# EAGLE design tiny-dcdc-2.0 (EAGLE 6.5.0)
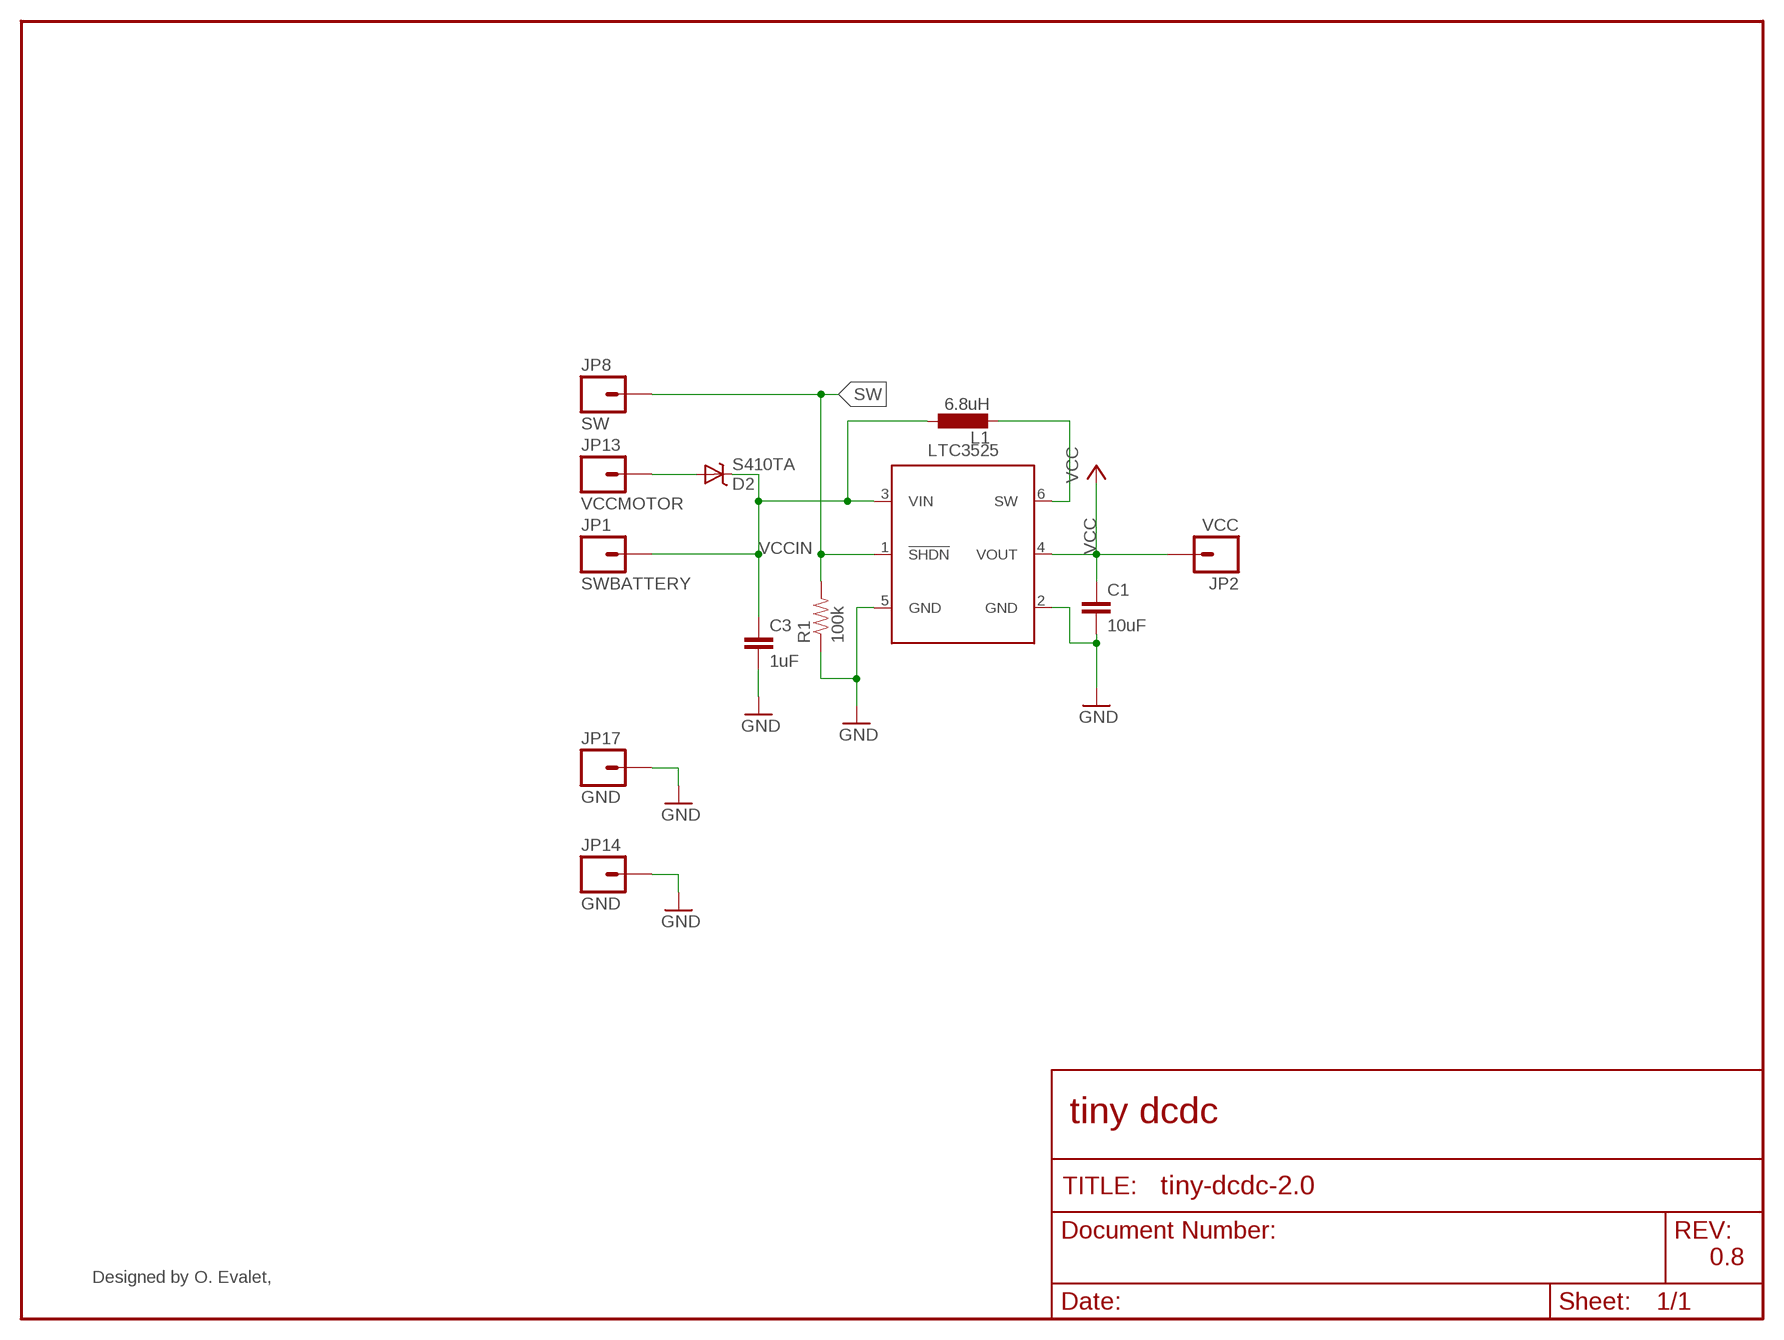
[diagram p0: schematic, sheet 1]

## Parts
C1  10uF  CAP0805  [0805]
C3  1uF  CAP0805  [0805]
D2  S410TA  DIODE-SCHOTTKYSOD323  [SOD-323]
JP1  SWBATTERY  M01URWERK-ROUND  [URWERK1X01]
JP2  VCC  M01URWERK-ROUND  [URWERK1X01]
JP8  SW  M01URWERK-ROUND  [URWERK1X01]
JP13  VCCMOTOR  M01URWERK-ROUND  [URWERK1X01]
JP14  GND  M01URWERK-ROUND  [URWERK1X01]
JP17  GND  M01URWERK-ROUND  [URWERK1X01]
L1  6.8uH  L-EUL2012C  [L2012C]
R1  100k  RESISTOR0805-RES  [0805]
U$3  LTC3525  [SC70-6L]

## Nets
GND: C1.2 C3.2 JP14.1 JP17.1 R1.1 U$3.2(GND) U$3.5(GND)
N$3: L1.2 U$3.6(SW)
SW: JP8.1 R1.2 U$3.1(!SHDN)
VCC: C1.1 JP2.1 U$3.4(VOUT)
VCCIN: C3.1 D2.1(C) JP1.1 L1.1 U$3.3(VIN)
VCCMOTOR: D2.2(A) JP13.1

## Notes on the sheet
- tiny dcdc
- 0.8
- Designed by O. Evalet,

## Library data of the parts
C1 C3 = 0-SparkFun:CAP: Capacitor Standard 0603 ceramic capacitor, and 0.1" leaded capacitor.
D2 = bicyclelab:DIODE-SCHOTTKY: ZLLS410 10V LOW LEAKAGE SCHOTTKY DIODE IN SOD323
JP1 JP2 JP8 JP13 JP14 JP17 = bicyclelab:M01: Header 1 Standard 1-pin 0.1" header. Use with straight break away headers (SKU : PRT-00116), right angle break away headers (PRT-00553), swiss pins (PRT-00743), machine pins (PRT-00117), and female headers (PRT-00115).
L1 = resistor:L-EU: INDUCTOR, European symbol
R1 = 0-SparkFun:RESISTOR: Resistor Basic schematic elements and footprints for 0603, 1206, and PTH resistors.
U$3 = bicyclelab:LTC3525

## Board
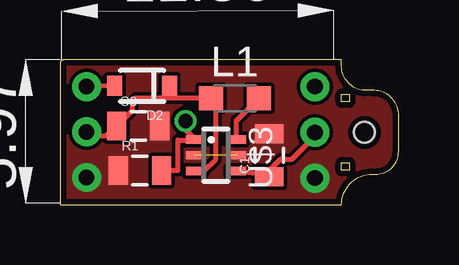
[diagram p1: board, top side]
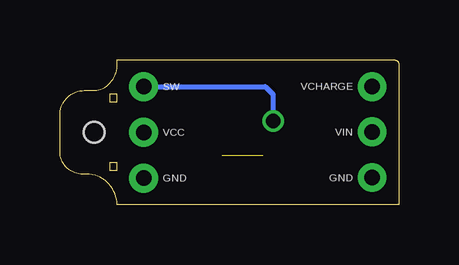
[diagram p2: board, bottom side, seen from below]

Size 14.13 x 6.03 mm. Coordinates in mm from the lower left corner, seen from the top.
Outline: 0,0 11.75,0 arc-90 13.02,1.27 13.18,1.27 arc90 14.13,2.22 14.13,3.81 arc90 13.02,4.76 12.7,4.76 arc-90 11.75,5.87 11.75,6.03 0.16,6.03 arc90 0,5.87 0,0
Outline: 11.75,4.6 12.06,4.6 12.06,4.29 11.75,4.29 11.75,4.6
Outline: 11.75,1.75 12.06,1.75 12.06,1.43 11.75,1.43 11.75,1.75
Copper layers (1*16): Top 0.035mm / dielectric 1.5mm / Bottom 0.035mm
Design rules "default": minimum track width 6mil, minimum drill 12mil, track to track 6mil, track to pad 6mil, pad to pad 6mil, via to via 6mil, smd to smd 0mil, copper to edge 10mil, drill to drill 10mil, minimum pad ring 10mil, minimum via ring 6mil, stop-mask expansion 2mil, vias tented up to drill 100mil, thermal gap 10mil
Holes 0.85 mm at 12.7,3.02

### Footprints (pad centres in the part's own frame; a part is rotated, then mirrored left to right if it is on the bottom)
0805 = smd 0.8 x 1.2: 1 -0.9,0; 2 0.9,0
SOD-323 = smd 0.63 x 0.83: 1 -1.15,0; 2 1.15,0
URWERK1X01 = drill 0.65 pad 1.2: 1 0,0
L2012C = smd 1 x 1: 1 -1,0; 2 1,0
SC70-6L = smd 0.35 x 0.8: 1 -0.65,-0.85; 2 0,-0.85; 3 0.65,-0.85; 4 0.65,0.85; 5 0,0.85; 6 -0.65,0.85

### Placement (x,y rotation side)
C1  8.73,2.06 90 top
C3  3.27,3.28 0 top
D2  3.43,4.95 180 top
JP1  1.11,3.04 90 top
JP2  10.64,3.02 0 top
JP8  10.64,4.92 90 top
JP13  1.11,4.92 90 top
JP14  10.64,1.11 270 top
JP17  1.11,1.14 0 top
L1  7.3,4.45 0 top
R1  3.33,1.43 0 top
U$3  6.51,2.06 270 top

### Tracks (layer width: path | path; a pad name or v marks a point on that pad's centre or on a via)
GND  (1 unrouted)
  pour Top (no thermals): 0,0 0,6.03 14.13,6.03 14.13,0
N$3
  Top 0.2: U$3.6 7.36,3.5 L1.2
SW  (via drill 0.6)
  Top 0.2: v5.24,3.49 5.24,3.13 U$3.1 5.66,2.7 4.92,2.7 4.92,1.43 R1.2
  Bottom 0.2: JP8.1 5.56,4.92 5.24,4.6 v5.24,3.49
VCC
  Top 0.2: U$3.4 8.66,1.25 C1.1 8.73,1.43 9.21,1.91 9.68,1.91 10.32,2.54 10.32,2.7 JP2.1
VCCIN
  Top 0.2: 4.77,4.45 L1.1 6.51,4.24 6.51,1.91 6.02,1.41 U$3.3 | 4.77,4.45 D2.1 | 4.77,4.45 3.17,4.45 3.02,4.29 3.02,3.93 C3.1 2.33,3.28 1.91,2.86 1.25,2.86 JP1.1
VCCMOTOR
  Top 0.2: D2.2 2.03,4.95 JP13.1

### Text on the board
bPlace: VCHARGE | SW | VIN | VCC | GND | GND